# Altium schematic sheet ScreenAdapterBoard2.SchDoc
size A4
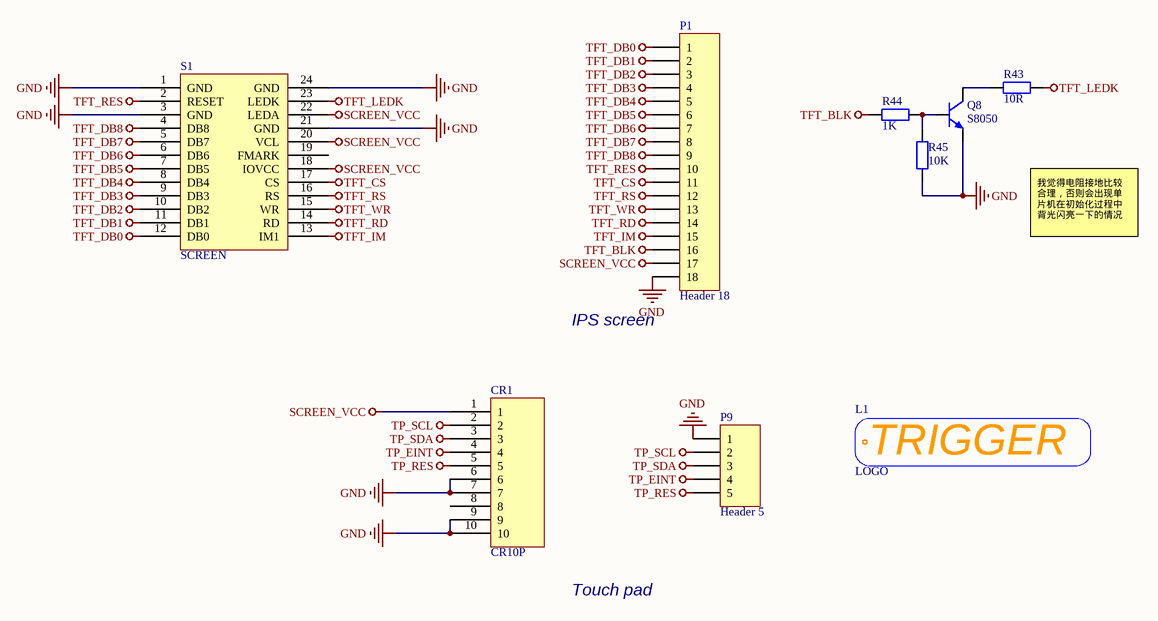
[diagram p0: ScreenAdapterBoard2.SchDoc]

## Parts
CR1  CR10P  [CONN RCPT 10POS 0.4MM]
L1  LOGO  [LOGO L BS]
P1  Header 18  [HDR1X18]
P9  Header 5  [HDR1X5]
Q8  S8050  [三极管_SOT-23]
R43  10R  [电阻_R0603]
R44  1K  [电阻_R0603]
R45  10K  [电阻_R0603]
S1  SCREEN  [CONN-SMD_DF37NC-24DS-0.4V(51)]

## Nets
GND: CR1.6 CR1.7 CR1.9 CR1.10 P1.18 P9.1 Q8.3(E) R45.1 S1.1(GND) S1.3(GND) S1.21(GND) S1.24(GND)
SCREEN_VCC: CR1.1 P1.17 S1.18(IOVCC) S1.20(VCL) S1.22(LEDA)
TFT_BLK: P1.16 R44.1
TFT_CS: P1.11 S1.17(CS)
TFT_DB0: P1.1 S1.12(DB0)
TFT_DB1: P1.2 S1.11(DB1)
TFT_DB2: P1.3 S1.10(DB2)
TFT_DB3: P1.4 S1.9(DB3)
TFT_DB4: P1.5 S1.8(DB4)
TFT_DB5: P1.6 S1.7(DB5)
TFT_DB6: P1.7 S1.6(DB6)
TFT_DB7: P1.8 S1.5(DB7)
TFT_DB8: P1.9 S1.4(DB8)
TFT_IM: P1.15 S1.13(IM1)
TFT_LEDK: R43.2 S1.23(LEDK)
TFT_RD: P1.14 S1.14(RD)
TFT_RES: P1.10 S1.2(RESET)
TFT_RS: P1.12 S1.16(RS)
TFT_WR: P1.13 S1.15(WR)
TP_EINT: CR1.4 P9.4
TP_RES: CR1.5 P9.5
TP_SCL: CR1.2 P9.2
TP_SDA: CR1.3 P9.3
NetQ8_1: Q8.1(B) R44.2 R45.2
NetQ8_2: Q8.2(C) R43.1

Not connected (* = marked no-connect by the designer): CR1 8; S1 19(FMARK)

## Notes on the sheet
- 我觉得电阻接地比较合理，否则会出现单片机在初始化过程中背光闪亮一下的情况
- (near P1) IPS screen
- Touch pad
- (in symbol LOGO_TRIGGER) TRIGGER

## Library data of the parts
CR1 = CONN RCPT 10P: 板对板连接器
L1 = LOGO_TRIGGER
P1 = Header 18: Header, 18-Pin; LatestRevisionDate: 17-Jul-2002; LatestRevisionNote: Re-released for DXP Platform.; Publisher: Altium Limited
P9 = Header 5: Header, 5-Pin; LatestRevisionDate: 17-Jul-2002; LatestRevisionNote: Re-released for DXP Platform.; Publisher: Altium Limited
Q8 = Triode-NPN: _Comma: ,; _Current: 500mA; _Footprint: SOT-23; _Name: Triode; _Specification: Triode,NPN,S8050,SOT-23,500mA,40V; _Voltage: 40V; _Polarity: NPN; _Model: S8050
R43 = Res: _Accuracy: 1%; _Power: 1/8W; _Footprint: 0805; _Drift: 100ppm; _Comma: ,; _Specification: Res,0805,10R,1%,1/8W,100ppm; _Name: Res; _Value: 10R
R44 = Res: _Accuracy: 1%; _Power: 1/8W; _Footprint: 0805; _Drift: 100ppm; _Comma: ,; _Specification: Res,0805,1K,1%,1/8W,100ppm; _Name: Res; _Value: 1K
R45 = Res: _Accuracy: 1%; _Power: 1/8W; _Footprint: 0805; _Drift: 100ppm; _Comma: ,; _Specification: Res,0805,10K,1%,1/8W,100ppm; _Name: Res; _Value: 10K
S1 = SCREEN 1.54  24P